# EAGLE schematic protol (EAGLE 6.6.0)

## Sheet 1 of 2
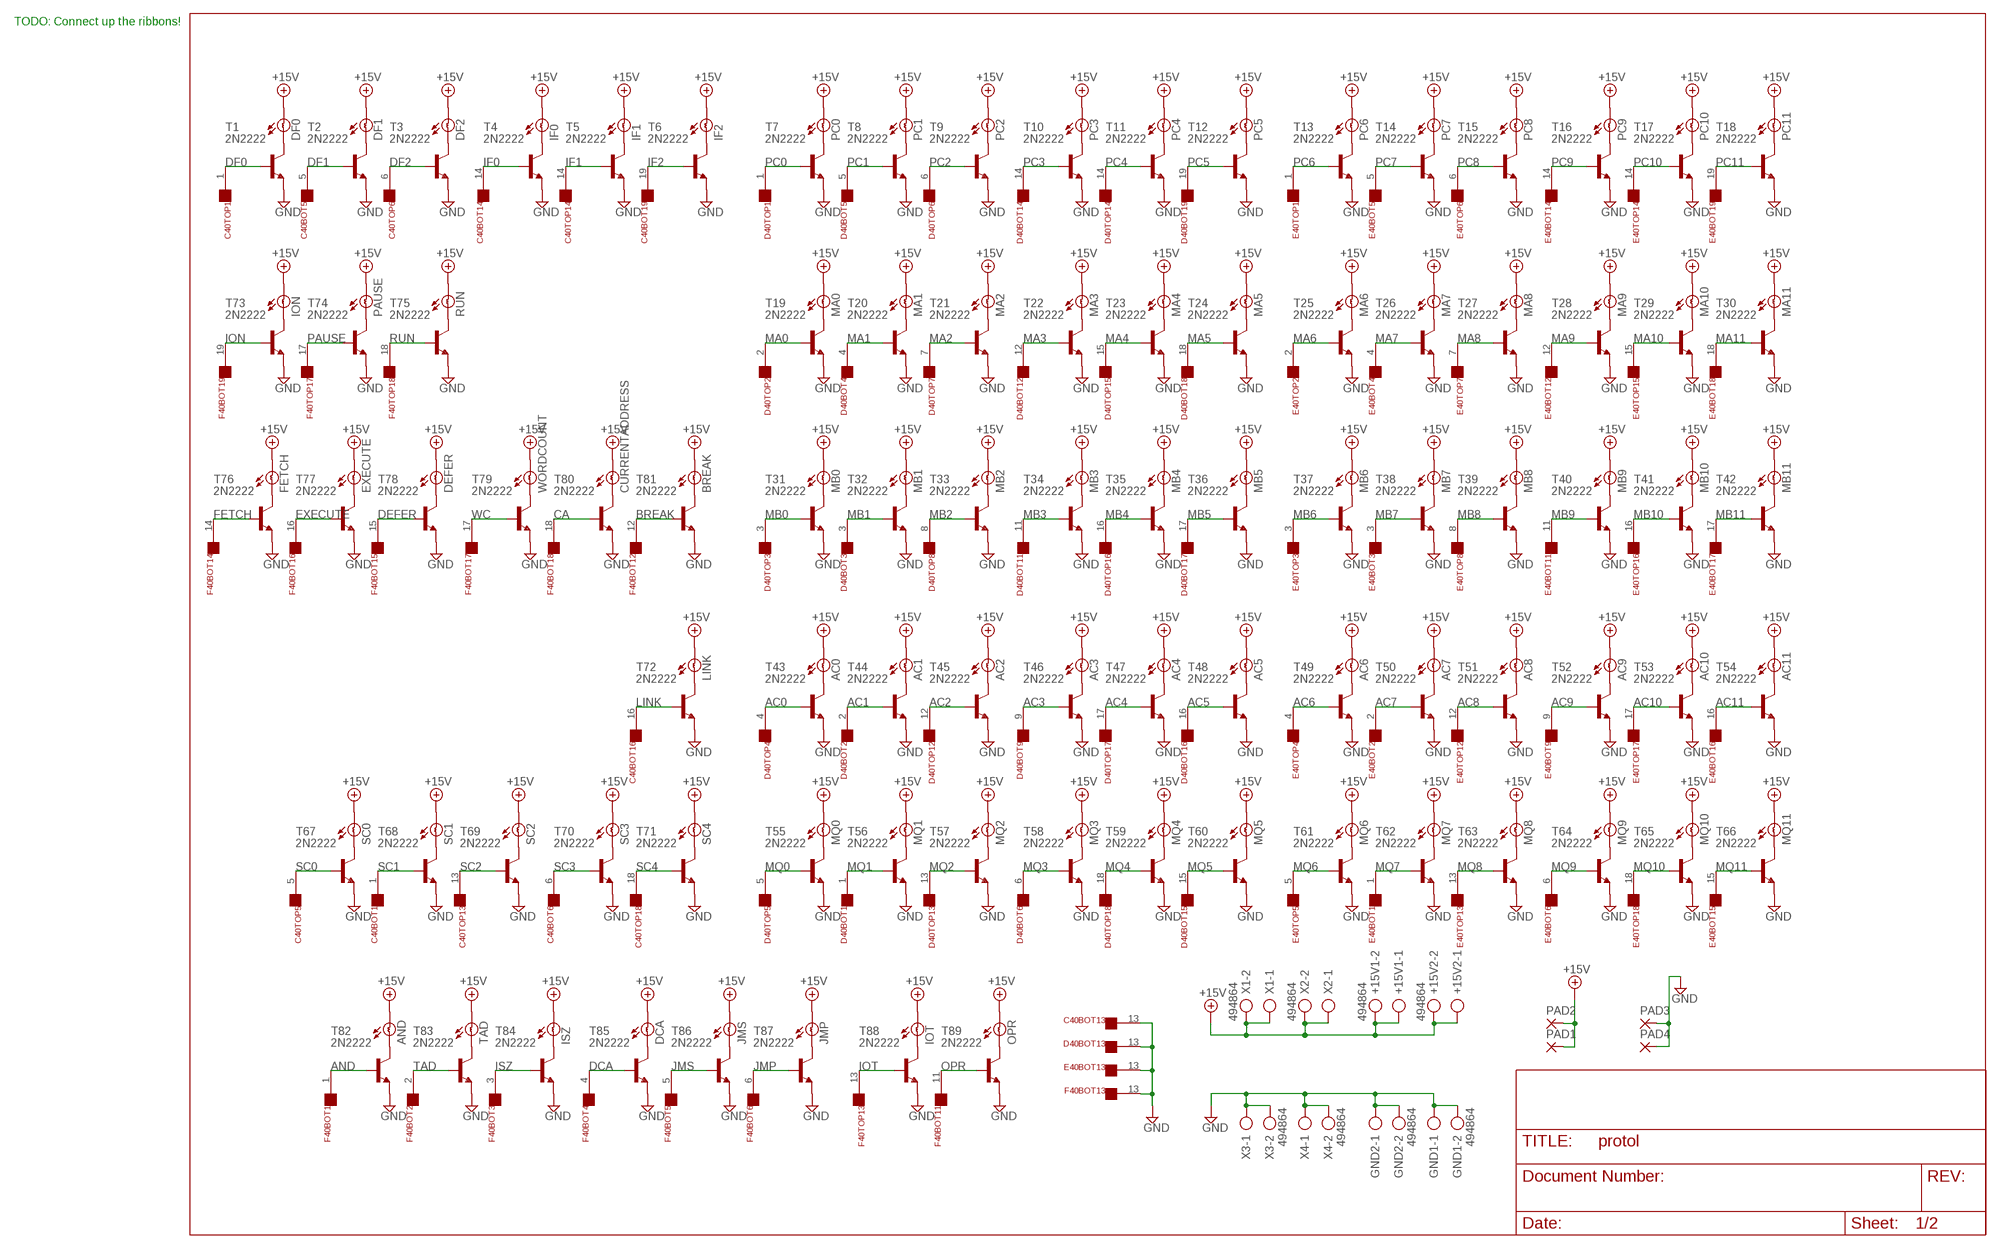
[diagram p0: schematic, sheet 1]

### Parts
+15V1  494864  AK500/2  [AK500/2]
+15V2  494864  AK500/2  [AK500/2]
AC0  BULB  [BULB]
AC1  BULB  [BULB]
AC2  BULB  [BULB]
AC3  BULB  [BULB]
AC4  BULB  [BULB]
AC5  BULB  [BULB]
AC6  BULB  [BULB]
AC7  BULB  [BULB]
AC8  BULB  [BULB]
AC9  BULB  [BULB]
AC10  BULB  [BULB]
AC11  BULB  [BULB]
AND  BULB  [BULB]
BREAK  BULB  [BULB]
C40BOT  FLEX19  [FLEX19]
C40TOP  FLEX19  [FLEX19]
CURRENTADDRESS  BULB  [BULB]
D40BOT  FLEX19  [FLEX19]
D40TOP  FLEX19  [FLEX19]
DCA  BULB  [BULB]
DEFER  BULB  [BULB]
DF0  BULB  [BULB]
DF1  BULB  [BULB]
DF2  BULB  [BULB]
E40BOT  FLEX19  [FLEX19]
E40TOP  FLEX19  [FLEX19]
EXECUTE  BULB  [BULB]
F40BOT  FLEX19  [FLEX19]
F40TOP  FLEX19  [FLEX19]
FETCH  BULB  [BULB]
GND1  494864  AK500/2  [AK500/2]
GND2  494864  AK500/2  [AK500/2]
IF0  BULB  [BULB]
IF1  BULB  [BULB]
IF2  BULB  [BULB]
ION  BULB  [BULB]
IOT  BULB  [BULB]
ISZ  BULB  [BULB]
JMP  BULB  [BULB]
JMS  BULB  [BULB]
LINK  BULB  [BULB]
MA0  BULB  [BULB]
MA1  BULB  [BULB]
MA2  BULB  [BULB]
MA3  BULB  [BULB]
MA4  BULB  [BULB]
MA5  BULB  [BULB]
MA6  BULB  [BULB]
MA7  BULB  [BULB]
MA8  BULB  [BULB]
MA9  BULB  [BULB]
MA10  BULB  [BULB]
MA11  BULB  [BULB]
MB0  BULB  [BULB]
MB1  BULB  [BULB]
MB2  BULB  [BULB]
MB3  BULB  [BULB]
MB4  BULB  [BULB]
MB5  BULB  [BULB]
MB6  BULB  [BULB]
MB7  BULB  [BULB]
MB8  BULB  [BULB]
MB9  BULB  [BULB]
MB10  BULB  [BULB]
MB11  BULB  [BULB]
MQ0  BULB  [BULB]
MQ1  BULB  [BULB]
MQ2  BULB  [BULB]
MQ3  BULB  [BULB]
MQ4  BULB  [BULB]
MQ5  BULB  [BULB]
MQ6  BULB  [BULB]
MQ7  BULB  [BULB]
MQ8  BULB  [BULB]
MQ9  BULB  [BULB]
MQ10  BULB  [BULB]
MQ11  BULB  [BULB]
OPR  BULB  [BULB]
PAD1  2,54/0,8  [2,54/0,8]
PAD2  2,54/0,8  [2,54/0,8]
PAD3  2,54/0,8  [2,54/0,8]
PAD4  2,54/0,8  [2,54/0,8]
PAUSE  BULB  [BULB]
PC0  BULB  [BULB]
PC1  BULB  [BULB]
PC2  BULB  [BULB]
PC3  BULB  [BULB]
PC4  BULB  [BULB]
PC5  BULB  [BULB]
PC6  BULB  [BULB]
PC7  BULB  [BULB]
PC8  BULB  [BULB]
PC9  BULB  [BULB]
PC10  BULB  [BULB]
PC11  BULB  [BULB]
RUN  BULB  [BULB]
SC0  BULB  [BULB]
SC1  BULB  [BULB]
SC2  BULB  [BULB]
SC3  BULB  [BULB]
SC4  BULB  [BULB]
T1  2N2222  -NPN-TO92  [TO92]
T2  2N2222  -NPN-TO92  [TO92]
T3  2N2222  -NPN-TO92  [TO92]
T4  2N2222  -NPN-TO92  [TO92]
T5  2N2222  -NPN-TO92  [TO92]
T6  2N2222  -NPN-TO92  [TO92]
T7  2N2222  -NPN-TO92  [TO92]
T8  2N2222  -NPN-TO92  [TO92]
T9  2N2222  -NPN-TO92  [TO92]
T10  2N2222  -NPN-TO92  [TO92]
T11  2N2222  -NPN-TO92  [TO92]
T12  2N2222  -NPN-TO92  [TO92]
T13  2N2222  -NPN-TO92  [TO92]
T14  2N2222  -NPN-TO92  [TO92]
T15  2N2222  -NPN-TO92  [TO92]
T16  2N2222  -NPN-TO92  [TO92]
T17  2N2222  -NPN-TO92  [TO92]
T18  2N2222  -NPN-TO92  [TO92]
T19  2N2222  -NPN-TO92  [TO92]
T20  2N2222  -NPN-TO92  [TO92]
T21  2N2222  -NPN-TO92  [TO92]
T22  2N2222  -NPN-TO92  [TO92]
T23  2N2222  -NPN-TO92  [TO92]
T24  2N2222  -NPN-TO92  [TO92]
T25  2N2222  -NPN-TO92  [TO92]
T26  2N2222  -NPN-TO92  [TO92]
T27  2N2222  -NPN-TO92  [TO92]
T28  2N2222  -NPN-TO92  [TO92]
T29  2N2222  -NPN-TO92  [TO92]
T30  2N2222  -NPN-TO92  [TO92]
T31  2N2222  -NPN-TO92  [TO92]
T32  2N2222  -NPN-TO92  [TO92]
T33  2N2222  -NPN-TO92  [TO92]
T34  2N2222  -NPN-TO92  [TO92]
T35  2N2222  -NPN-TO92  [TO92]
T36  2N2222  -NPN-TO92  [TO92]
T37  2N2222  -NPN-TO92  [TO92]
T38  2N2222  -NPN-TO92  [TO92]
T39  2N2222  -NPN-TO92  [TO92]
T40  2N2222  -NPN-TO92  [TO92]
T41  2N2222  -NPN-TO92  [TO92]
T42  2N2222  -NPN-TO92  [TO92]
T43  2N2222  -NPN-TO92  [TO92]
T44  2N2222  -NPN-TO92  [TO92]
T45  2N2222  -NPN-TO92  [TO92]
T46  2N2222  -NPN-TO92  [TO92]
T47  2N2222  -NPN-TO92  [TO92]
T48  2N2222  -NPN-TO92  [TO92]
T49  2N2222  -NPN-TO92  [TO92]
T50  2N2222  -NPN-TO92  [TO92]
T51  2N2222  -NPN-TO92  [TO92]
T52  2N2222  -NPN-TO92  [TO92]
T53  2N2222  -NPN-TO92  [TO92]
T54  2N2222  -NPN-TO92  [TO92]
T55  2N2222  -NPN-TO92  [TO92]
T56  2N2222  -NPN-TO92  [TO92]
T57  2N2222  -NPN-TO92  [TO92]
T58  2N2222  -NPN-TO92  [TO92]
T59  2N2222  -NPN-TO92  [TO92]
T60  2N2222  -NPN-TO92  [TO92]
T61  2N2222  -NPN-TO92  [TO92]
T62  2N2222  -NPN-TO92  [TO92]
T63  2N2222  -NPN-TO92  [TO92]
T64  2N2222  -NPN-TO92  [TO92]
T65  2N2222  -NPN-TO92  [TO92]
T66  2N2222  -NPN-TO92  [TO92]
T67  2N2222  -NPN-TO92  [TO92]
T68  2N2222  -NPN-TO92  [TO92]
T69  2N2222  -NPN-TO92  [TO92]
T70  2N2222  -NPN-TO92  [TO92]
T71  2N2222  -NPN-TO92  [TO92]
T72  2N2222  -NPN-TO92  [TO92]
T73  2N2222  -NPN-TO92  [TO92]
T74  2N2222  -NPN-TO92  [TO92]
T75  2N2222  -NPN-TO92  [TO92]
T76  2N2222  -NPN-TO92  [TO92]
T77  2N2222  -NPN-TO92  [TO92]
T78  2N2222  -NPN-TO92  [TO92]
T79  2N2222  -NPN-TO92  [TO92]
T80  2N2222  -NPN-TO92  [TO92]
T81  2N2222  -NPN-TO92  [TO92]
T82  2N2222  -NPN-TO92  [TO92]
T83  2N2222  -NPN-TO92  [TO92]
T84  2N2222  -NPN-TO92  [TO92]
T85  2N2222  -NPN-TO92  [TO92]
T86  2N2222  -NPN-TO92  [TO92]
T87  2N2222  -NPN-TO92  [TO92]
T88  2N2222  -NPN-TO92  [TO92]
T89  2N2222  -NPN-TO92  [TO92]
TAD  BULB  [BULB]
WORDCOUNT  BULB  [BULB]
X1  494864  AK500/2  [AK500/2]
X2  494864  AK500/2  [AK500/2]
X3  494864  AK500/2  [AK500/2]
X4  494864  AK500/2  [AK500/2]

### Nets
+15V [supply]: +15V1.1 +15V1.2 +15V2.1 +15V2.2 AC0.A AC1.A AC2.A AC3.A AC4.A AC5.A AC6.A AC7.A AC8.A AC9.A AC10.A AC11.A AND.A BREAK.A CURRENTADDRESS.A DCA.A DEFER.A DF0.A DF1.A DF2.A EXECUTE.A FETCH.A IF0.A IF1.A IF2.A ION.A IOT.A ISZ.A JMP.A JMS.A LINK.A MA0.A MA1.A MA2.A MA3.A MA4.A MA5.A MA6.A MA7.A MA8.A MA9.A MA10.A MA11.A MB0.A MB1.A MB2.A MB3.A MB4.A MB5.A MB6.A MB7.A MB8.A MB9.A MB10.A MB11.A MQ0.A MQ1.A MQ2.A MQ3.A MQ4.A MQ5.A MQ6.A MQ7.A MQ8.A MQ9.A MQ10.A MQ11.A OPR.A PAD1.1(P) PAD2.1(P) PAUSE.A PC0.A PC1.A PC2.A PC3.A PC4.A PC5.A PC6.A PC7.A PC8.A PC9.A PC10.A PC11.A RUN.A SC0.A SC1.A SC2.A SC3.A SC4.A TAD.A WORDCOUNT.A X1.1 X1.2 X2.1 X2.2
AC0: D40TOP.4 T43.2(B) ; also sheet 2
AC1: D40BOT.2 T44.2(B) ; also sheet 2
AC2: D40TOP.12 T45.2(B) ; also sheet 2
AC3: D40BOT.9 T46.2(B) ; also sheet 2
AC4: D40TOP.17 T47.2(B) ; also sheet 2
AC5: D40BOT.16 T48.2(B) ; also sheet 2
AC6: E40TOP.4 T49.2(B) ; also sheet 2
AC7: E40BOT.2 T50.2(B) ; also sheet 2
AC8: E40TOP.12 T51.2(B) ; also sheet 2
AC9: E40BOT.9 T52.2(B) ; also sheet 2
AC10: E40TOP.17 T53.2(B) ; also sheet 2
AC11: E40BOT.16 T54.2(B) ; also sheet 2
AND: F40BOT.1 T82.2(B) ; also sheet 2
BREAK: F40BOT.12 T81.2(B) ; also sheet 2
CA: F40BOT.18 T80.2(B) ; also sheet 2
DCA: F40BOT.4 T85.2(B) ; also sheet 2
DEFER: F40BOT.15 T78.2(B) ; also sheet 2
DF0: C40TOP.1 T1.2(B) ; also sheet 2
DF1: C40BOT.5 T2.2(B) ; also sheet 2
DF2: C40TOP.6 T3.2(B) ; also sheet 2
EXECUTE: F40BOT.16 T77.2(B) ; also sheet 2
FETCH: F40BOT.14 T76.2(B) ; also sheet 2
GND [supply]: C40BOT.13 D40BOT.13 E40BOT.13 F40BOT.13 GND1.1 GND1.2 GND2.1 GND2.2 PAD3.1(P) PAD4.1(P) T1.1(E) T2.1(E) T3.1(E) T4.1(E) T5.1(E) T6.1(E) T7.1(E) T8.1(E) T9.1(E) T10.1(E) T11.1(E) T12.1(E) T13.1(E) T14.1(E) T15.1(E) T16.1(E) T17.1(E) T18.1(E) T19.1(E) T20.1(E) T21.1(E) T22.1(E) T23.1(E) T24.1(E) T25.1(E) T26.1(E) T27.1(E) T28.1(E) T29.1(E) T30.1(E) T31.1(E) T32.1(E) T33.1(E) T34.1(E) T35.1(E) T36.1(E) T37.1(E) T38.1(E) T39.1(E) T40.1(E) T41.1(E) T42.1(E) T43.1(E) T44.1(E) T45.1(E) T46.1(E) T47.1(E) T48.1(E) T49.1(E) T50.1(E) T51.1(E) T52.1(E) T53.1(E) T54.1(E) T55.1(E) T56.1(E) T57.1(E) T58.1(E) T59.1(E) T60.1(E) T61.1(E) T62.1(E) T63.1(E) T64.1(E) T65.1(E) T66.1(E) T67.1(E) T68.1(E) T69.1(E) T70.1(E) T71.1(E) T72.1(E) T73.1(E) T74.1(E) T75.1(E) T76.1(E) T77.1(E) T78.1(E) T79.1(E) T80.1(E) T81.1(E) T82.1(E) T83.1(E) T84.1(E) T85.1(E) T86.1(E) T87.1(E) T88.1(E) T89.1(E) X3.1 X3.2 X4.1 X4.2 ; also sheet 2
IF0: C40BOT.14 T4.2(B) ; also sheet 2
IF1: C40TOP.14 T5.2(B) ; also sheet 2
IF2: C40BOT.19 T6.2(B) ; also sheet 2
ION: F40BOT.19 T73.2(B) ; also sheet 2
IOT: F40TOP.13 T88.2(B) ; also sheet 2
ISZ: F40BOT.3 T84.2(B) ; also sheet 2
JMP: F40BOT.6 T87.2(B) ; also sheet 2
JMS: F40BOT.5 T86.2(B) ; also sheet 2
LINK: C40BOT.16 T72.2(B) ; also sheet 2
MA0: D40TOP.2 T19.2(B) ; also sheet 2
MA1: D40BOT.4 T20.2(B) ; also sheet 2
MA2: D40TOP.7 T21.2(B) ; also sheet 2
MA3: D40BOT.12 T22.2(B) ; also sheet 2
MA4: D40TOP.15 T23.2(B) ; also sheet 2
MA5: D40BOT.18 T24.2(B) ; also sheet 2
MA6: E40TOP.2 T25.2(B) ; also sheet 2
MA7: E40BOT.4 T26.2(B) ; also sheet 2
MA8: E40TOP.7 T27.2(B) ; also sheet 2
MA9: E40BOT.12 T28.2(B) ; also sheet 2
MA10: E40TOP.15 T29.2(B) ; also sheet 2
MA11: E40BOT.18 T30.2(B) ; also sheet 2
MB0: D40TOP.3 T31.2(B) ; also sheet 2
MB1: D40BOT.3 T32.2(B) ; also sheet 2
MB2: D40TOP.8 T33.2(B) ; also sheet 2
MB3: D40BOT.11 T34.2(B) ; also sheet 2
MB4: D40TOP.16 T35.2(B) ; also sheet 2
MB5: D40BOT.17 T36.2(B) ; also sheet 2
MB6: E40TOP.3 T37.2(B) ; also sheet 2
MB7: E40BOT.3 T38.2(B) ; also sheet 2
MB8: E40TOP.8 T39.2(B) ; also sheet 2
MB9: E40BOT.11 T40.2(B) ; also sheet 2
MB10: E40TOP.16 T41.2(B) ; also sheet 2
MB11: E40BOT.17 T42.2(B) ; also sheet 2
MQ0: D40TOP.5 T55.2(B) ; also sheet 2
MQ1: D40BOT.1 T56.2(B) ; also sheet 2
MQ2: D40TOP.13 T57.2(B) ; also sheet 2
MQ3: D40BOT.6 T58.2(B) ; also sheet 2
MQ4: D40TOP.18 T59.2(B) ; also sheet 2
MQ5: D40BOT.15 T60.2(B) ; also sheet 2
MQ6: E40TOP.5 T61.2(B) ; also sheet 2
MQ7: E40BOT.1 T62.2(B) ; also sheet 2
MQ8: E40TOP.13 T63.2(B) ; also sheet 2
MQ9: E40BOT.6 T64.2(B) ; also sheet 2
MQ10: E40TOP.18 T65.2(B) ; also sheet 2
MQ11: E40BOT.15 T66.2(B) ; also sheet 2
N$1: DF0.B T1.3(C)
N$2: DF1.B T2.3(C)
N$3: DF2.B T3.3(C)
N$4: IF0.B T4.3(C)
N$5: IF1.B T5.3(C)
N$6: IF2.B T6.3(C)
N$7: PC0.B T7.3(C)
N$8: PC1.B T8.3(C)
N$9: PC2.B T9.3(C)
N$10: PC3.B T10.3(C)
N$11: PC4.B T11.3(C)
N$12: PC5.B T12.3(C)
N$13: PC6.B T13.3(C)
N$14: PC7.B T14.3(C)
N$15: PC8.B T15.3(C)
N$16: PC9.B T16.3(C)
N$17: PC10.B T17.3(C)
N$18: PC11.B T18.3(C)
N$19: MA0.B T19.3(C)
N$20: MA1.B T20.3(C)
N$21: MA2.B T21.3(C)
N$22: MA3.B T22.3(C)
N$23: MA4.B T23.3(C)
N$24: MA5.B T24.3(C)
N$25: MA6.B T25.3(C)
N$26: MA7.B T26.3(C)
N$27: MA8.B T27.3(C)
N$28: MA9.B T28.3(C)
N$29: MA10.B T29.3(C)
N$30: MA11.B T30.3(C)
N$31: MB0.B T31.3(C)
N$32: MB1.B T32.3(C)
N$33: MB2.B T33.3(C)
N$34: MB3.B T34.3(C)
N$35: MB4.B T35.3(C)
N$36: MB5.B T36.3(C)
N$37: MB6.B T37.3(C)
N$38: MB7.B T38.3(C)
N$39: MB8.B T39.3(C)
N$40: MB9.B T40.3(C)
N$41: MB10.B T41.3(C)
N$42: MB11.B T42.3(C)
N$43: AC0.B T43.3(C)
N$44: AC1.B T44.3(C)
N$45: AC2.B T45.3(C)
N$46: AC3.B T46.3(C)
N$47: AC4.B T47.3(C)
N$48: AC5.B T48.3(C)
N$49: AC6.B T49.3(C)
N$50: AC7.B T50.3(C)
N$51: AC8.B T51.3(C)
N$52: AC9.B T52.3(C)
N$53: AC10.B T53.3(C)
N$54: AC11.B T54.3(C)
N$55: MQ0.B T55.3(C)
N$56: MQ1.B T56.3(C)
N$57: MQ2.B T57.3(C)
N$58: MQ3.B T58.3(C)
N$59: MQ4.B T59.3(C)
N$60: MQ5.B T60.3(C)
N$61: MQ6.B T61.3(C)
N$62: MQ7.B T62.3(C)
N$63: MQ8.B T63.3(C)
N$64: MQ9.B T64.3(C)
N$65: MQ10.B T65.3(C)
N$66: MQ11.B T66.3(C)
N$67: SC0.B T67.3(C)
N$68: SC1.B T68.3(C)
N$69: SC2.B T69.3(C)
N$70: SC3.B T70.3(C)
N$71: SC4.B T71.3(C)
N$72: LINK.B T72.3(C)
N$73: ION.B T73.3(C)
N$74: PAUSE.B T74.3(C)
N$75: RUN.B T75.3(C)
N$76: FETCH.B T76.3(C)
N$77: EXECUTE.B T77.3(C)
N$78: DEFER.B T78.3(C)
N$79: T79.3(C) WORDCOUNT.B
N$80: CURRENTADDRESS.B T80.3(C)
N$81: BREAK.B T81.3(C)
N$82: AND.B T82.3(C)
N$83: T83.3(C) TAD.B
N$84: ISZ.B T84.3(C)
N$85: DCA.B T85.3(C)
N$86: JMS.B T86.3(C)
N$87: JMP.B T87.3(C)
N$88: IOT.B T88.3(C)
N$89: OPR.B T89.3(C)
OPR: F40BOT.11 T89.2(B) ; also sheet 2
PAUSE: F40TOP.17 T74.2(B) ; also sheet 2
PC0: D40TOP.1 T7.2(B) ; also sheet 2
PC1: D40BOT.5 T8.2(B) ; also sheet 2
PC2: D40TOP.6 T9.2(B) ; also sheet 2
PC3: D40BOT.14 T10.2(B) ; also sheet 2
PC4: D40TOP.14 T11.2(B) ; also sheet 2
PC5: D40BOT.19 T12.2(B) ; also sheet 2
PC6: E40TOP.1 T13.2(B) ; also sheet 2
PC7: E40BOT.5 T14.2(B) ; also sheet 2
PC8: E40TOP.6 T15.2(B) ; also sheet 2
PC9: E40BOT.14 T16.2(B) ; also sheet 2
PC10: E40TOP.14 T17.2(B) ; also sheet 2
PC11: E40BOT.19 T18.2(B) ; also sheet 2
RUN: F40TOP.18 T75.2(B) ; also sheet 2
SC0: C40TOP.5 T67.2(B) ; also sheet 2
SC1: C40BOT.1 T68.2(B) ; also sheet 2
SC2: C40TOP.13 T69.2(B) ; also sheet 2
SC3: C40BOT.6 T70.2(B) ; also sheet 2
SC4: C40TOP.18 T71.2(B) ; also sheet 2
TAD: F40BOT.2 T83.2(B) ; also sheet 2
WC: F40BOT.17 T79.2(B) ; also sheet 2
Unconnected: C40BOT.2 C40BOT.3 C40BOT.4 C40BOT.7 C40BOT.8 C40BOT.9 C40BOT.10 C40BOT.11 C40BOT.12 C40BOT.15 C40BOT.17 C40BOT.18 C40TOP.2 C40TOP.3 C40TOP.4 C40TOP.7 C40TOP.8 C40TOP.9 C40TOP.10 C40TOP.11 C40TOP.12 C40TOP.15 C40TOP.16 C40TOP.17 C40TOP.19 D40BOT.7 D40BOT.8 D40BOT.10 D40TOP.9 D40TOP.10 D40TOP.11 D40TOP.19 E40BOT.7 E40BOT.8 E40BOT.10 E40TOP.9 E40TOP.10 E40TOP.11 E40TOP.19 F40BOT.7 F40BOT.8 F40BOT.9 F40BOT.10 F40TOP.1 F40TOP.2 F40TOP.3 F40TOP.4 F40TOP.5 F40TOP.6 F40TOP.7 F40TOP.8 F40TOP.9 F40TOP.10 F40TOP.11 F40TOP.12 F40TOP.14 F40TOP.15 F40TOP.16 F40TOP.19

### Notes on the sheet
- TODO: Connect up the ribbons!

## Sheet 2 of 2
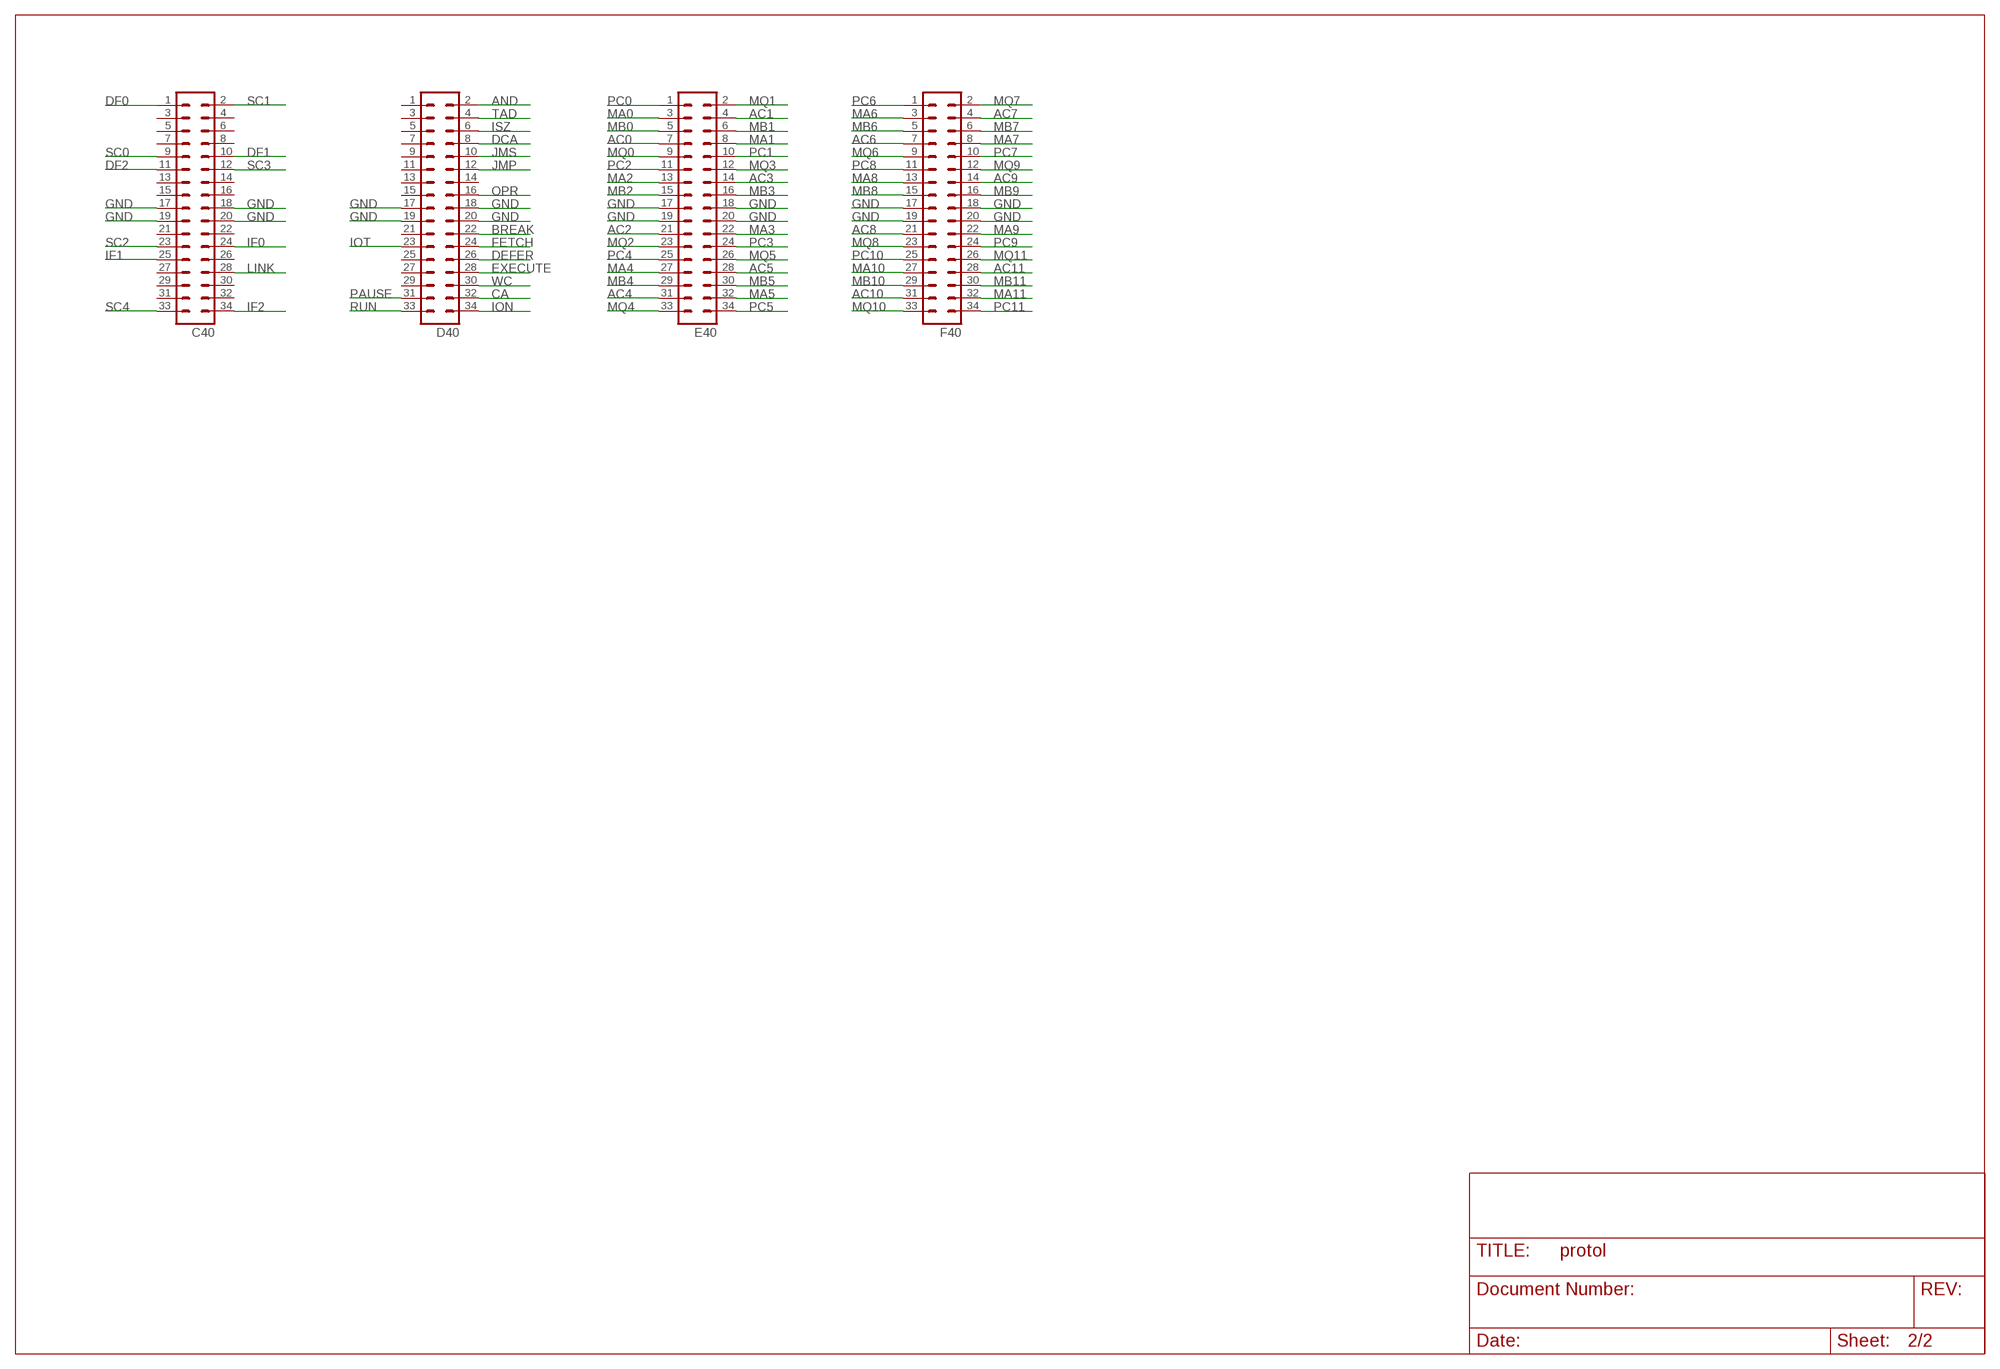
[diagram p1: schematic, sheet 2]

### Parts
C40  MA17-2  [MA17-2]
D40  MA17-2  [MA17-2]
E40  MA17-2  [MA17-2]
F40  MA17-2  [MA17-2]

### Nets
AC0: E40.7 ; also sheet 1
AC1: E40.4 ; also sheet 1
AC2: E40.21 ; also sheet 1
AC3: E40.14 ; also sheet 1
AC4: E40.31 ; also sheet 1
AC5: E40.28 ; also sheet 1
AC6: F40.7 ; also sheet 1
AC7: F40.4 ; also sheet 1
AC8: F40.21 ; also sheet 1
AC9: F40.14 ; also sheet 1
AC10: F40.31 ; also sheet 1
AC11: F40.28 ; also sheet 1
AND: D40.2 ; also sheet 1
BREAK: D40.22 ; also sheet 1
CA: D40.32 ; also sheet 1
DCA: D40.8 ; also sheet 1
DEFER: D40.26 ; also sheet 1
DF0: C40.1 ; also sheet 1
DF1: C40.10 ; also sheet 1
DF2: C40.11 ; also sheet 1
EXECUTE: D40.28 ; also sheet 1
FETCH: D40.24 ; also sheet 1
GND [supply]: C40.17 C40.18 C40.19 C40.20 D40.17 D40.18 D40.19 D40.20 E40.17 E40.18 E40.19 E40.20 F40.17 F40.18 F40.19 F40.20 ; also sheet 1
IF0: C40.24 ; also sheet 1
IF1: C40.25 ; also sheet 1
IF2: C40.34 ; also sheet 1
ION: D40.34 ; also sheet 1
IOT: D40.23 ; also sheet 1
ISZ: D40.6 ; also sheet 1
JMP: D40.12 ; also sheet 1
JMS: D40.10 ; also sheet 1
LINK: C40.28 ; also sheet 1
MA0: E40.3 ; also sheet 1
MA1: E40.8 ; also sheet 1
MA2: E40.13 ; also sheet 1
MA3: E40.22 ; also sheet 1
MA4: E40.27 ; also sheet 1
MA5: E40.32 ; also sheet 1
MA6: F40.3 ; also sheet 1
MA7: F40.8 ; also sheet 1
MA8: F40.13 ; also sheet 1
MA9: F40.22 ; also sheet 1
MA10: F40.27 ; also sheet 1
MA11: F40.32 ; also sheet 1
MB0: E40.5 ; also sheet 1
MB1: E40.6 ; also sheet 1
MB2: E40.15 ; also sheet 1
MB3: E40.16 ; also sheet 1
MB4: E40.29 ; also sheet 1
MB5: E40.30 ; also sheet 1
MB6: F40.5 ; also sheet 1
MB7: F40.6 ; also sheet 1
MB8: F40.15 ; also sheet 1
MB9: F40.16 ; also sheet 1
MB10: F40.29 ; also sheet 1
MB11: F40.30 ; also sheet 1
MQ0: E40.9 ; also sheet 1
MQ1: E40.2 ; also sheet 1
MQ2: E40.23 ; also sheet 1
MQ3: E40.12 ; also sheet 1
MQ4: E40.33 ; also sheet 1
MQ5: E40.26 ; also sheet 1
MQ6: F40.9 ; also sheet 1
MQ7: F40.2 ; also sheet 1
MQ8: F40.23 ; also sheet 1
MQ9: F40.12 ; also sheet 1
MQ10: F40.33 ; also sheet 1
MQ11: F40.26 ; also sheet 1
OPR: D40.16 ; also sheet 1
PAUSE: D40.31 ; also sheet 1
PC0: E40.1 ; also sheet 1
PC1: E40.10 ; also sheet 1
PC2: E40.11 ; also sheet 1
PC3: E40.24 ; also sheet 1
PC4: E40.25 ; also sheet 1
PC5: E40.34 ; also sheet 1
PC6: F40.1 ; also sheet 1
PC7: F40.10 ; also sheet 1
PC8: F40.11 ; also sheet 1
PC9: F40.24 ; also sheet 1
PC10: F40.25 ; also sheet 1
PC11: F40.34 ; also sheet 1
RUN: D40.33 ; also sheet 1
SC0: C40.9 ; also sheet 1
SC1: C40.2 ; also sheet 1
SC2: C40.23 ; also sheet 1
SC3: C40.12 ; also sheet 1
SC4: C40.33 ; also sheet 1
TAD: D40.4 ; also sheet 1
WC: D40.30 ; also sheet 1
Unconnected: C40.3 C40.4 C40.5 C40.6 C40.7 C40.8 C40.13 C40.14 C40.15 C40.16 C40.21 C40.22 C40.26 C40.27 C40.29 C40.30 C40.31 C40.32 D40.1 D40.3 D40.5 D40.7 D40.9 D40.11 D40.13 D40.14 D40.15 D40.21 D40.25 D40.27 D40.29

## Library data of the parts
+15V1 +15V2 GND1 GND2 X1-X4 = con-ptr500:AK500/2: CONNECTOR; OC_FARNELL: unknown; OC_NEWARK: unknown
AC0 AC1-AC11 AND BREAK CURRENTADDRESS DCA DEFER DF0 DF1 DF2 EXECUTE FETCH IF0 IF1 IF2 ION IOT ISZ JMP JMS LINK MA0 MA1-MA11 MB0 MB1-MB11 MQ0 MQ1-MQ11 OPR PAUSE PC0 PC1-PC11 RUN SC0 SC1-SC4 TAD WORDCOUNT = dec-con:BULB: T 1 3/4 Bulb
C40 D40 E40 F40 = con-lstb:MA17-2: PIN HEADER; OC_FARNELL: unknown; OC_NEWARK: unknown
C40BOT C40TOP D40BOT D40TOP E40BOT E40TOP F40BOT F40TOP = dec-con:FLEX19: 19 pin Flexprint Connection
PAD1-PAD4 = wirepad:2,54/0,8: THROUGH-HOLE PAD
T1-T89 = transistor:*-NPN-: NPN Transistror BF959 corrected 2008.03.06

## Net classes
1 supply: width 0.762 mm